# EAGLE schematic CAM_BOARD_V1_X (EAGLE 9.6.2)
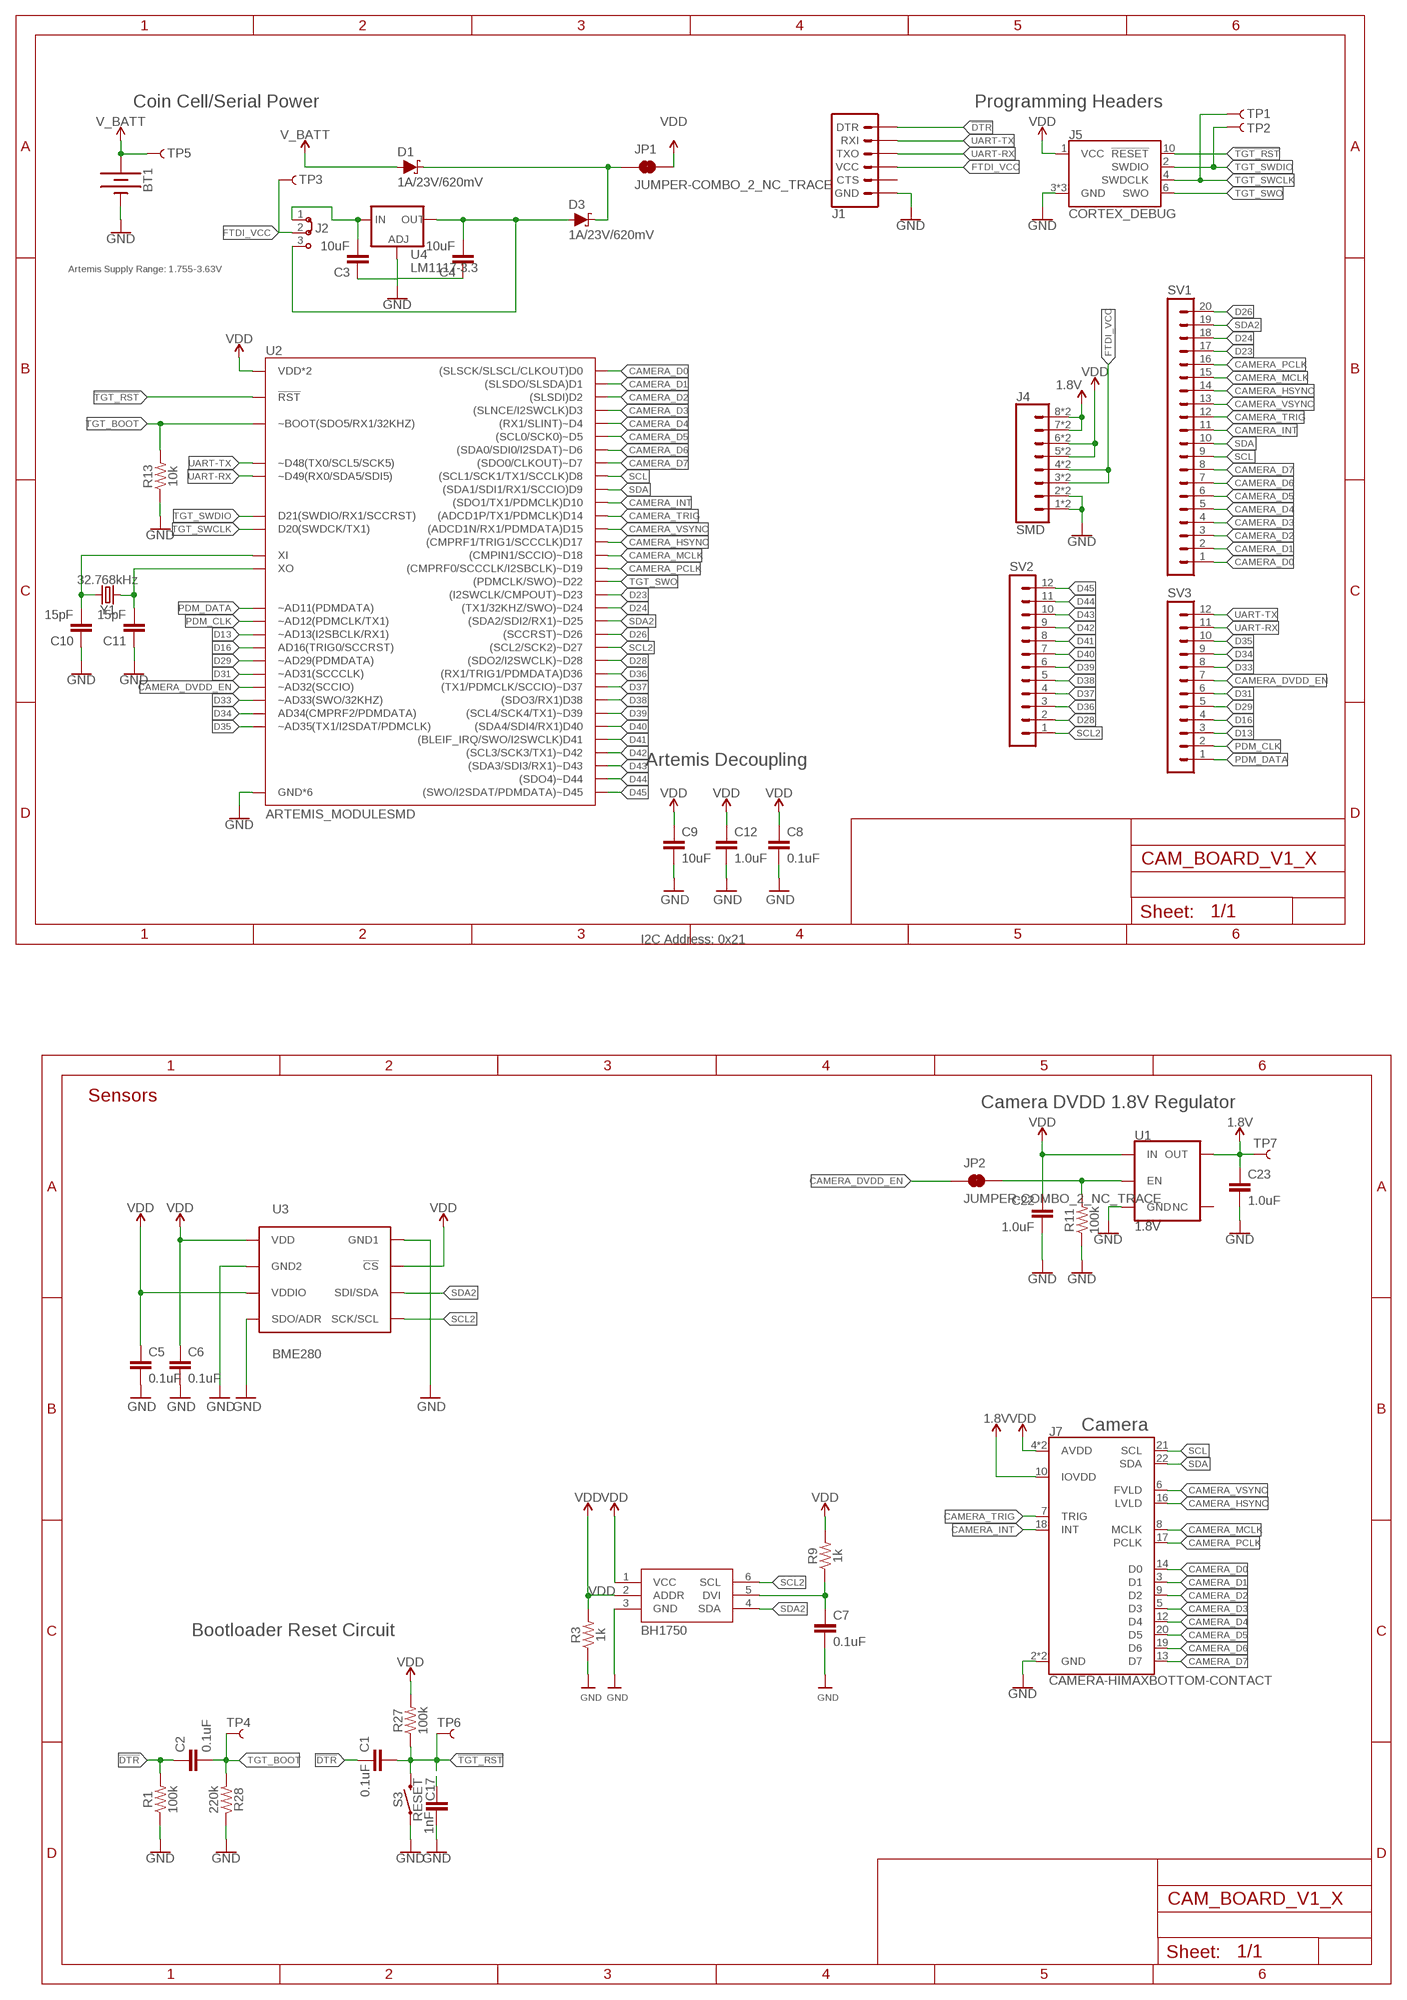
[diagram p0: schematic, sheet 1]

## Parts
BT1  BATTERY-20MM_SMD_4LEGS_OVERPASTE_INNER  [BATTCON_20MM_4LEGS_OVERPASTE_INNER]
C1  0.1uF  0.1UF-0603-25V-5%  [0603]
C2  0.1uF  0.1UF-0603-25V-(+80/-20%)  [0603]
C3  10uF  15PF-0603-50V-5%  [0603]
C4  10uF  15PF-0603-50V-5%  [0603]
C5  0.1uF  0.1UF-25V-5%(0603)  [0603-CAP]
C6  0.1uF  0.1UF-25V-5%(0603)  [0603-CAP]
C7  0.1uF  0.1UF-25V-5%(0603)  [0603-CAP]
C8  0.1uF  0.1UF-0402T-16V-10%  [0402-TIGHT]
C9  10uF  10UF-0603-6.3V-20%  [0603]
C10  15pF  15PF-0603-50V-5%  [0603]
C11  15pF  15PF-0603-50V-5%  [0603]
C12  1.0uF  1.0UF-0402T-16V-10%  [0402-TIGHT]
C17  1nF  1.0NF/1000PF-0603-50V-10%  [0603]
C22  1.0uF  1.0UF-0402-TIGHT-16V-10%  [0402-TIGHT]
C23  1.0uF  1.0UF-0402-TIGHT-16V-10%  [0402-TIGHT]
D1  1A/23V/620mV  DIODE-SCHOTTKY-BAT20J  [SOD-323]
D3  1A/23V/620mV  DIODE-SCHOTTKY-BAT20J  [SOD-323]
IC1  BH1750  [WSOF-6]
J1  6_PIN_SERIAL_TARGETSMD  [1X06-SMD_RA_MALE]
J2  J2X2MM  [04C]
J4  SMD  CONN_08SMD-COMBO-FEMALE  [1X08_SMD_COMBINED]
J5  CORTEX_DEBUG  CORTEX_DEBUG_MINIMUM_PTH  [2X5-PTH-1.27MM]
J7  CAMERA-HIMAXBOTTOM-CONTACT  [FPC-24-AMPHENOL-SFV24R-1STE1HLF]
JP1  JUMPER-COMBO_2_NC_TRACE  [COMBO-JUMPER_2_NC_TRACE]
JP2  JUMPER-COMBO_2_NC_TRACE  [COMBO-JUMPER_2_NC_TRACE]
R1  100k  100KOHM-0603-1/10W-1%  [0603]
R3  1k  1KOHM-0603-1/10W-1%  [0603@1]
R9  1k  1KOHM-0603-1/10W-1%  [0603@1]
R11  100k  100KOHM-0402T-1/16W-1%  [0402-TIGHT]
R13  10k  10KOHM-0603-1/10W-1%  [0603@1]
R27  100k  100KOHM-0603-1/10W-1%  [0603]
R28  220k  220KOHM-0603-1/10W-1%  [0603]
S3  RESET  MOMENTARY-SWITCH-SPST-SMD-4.6X2.8MM  [TACTILE_SWITCH_SMD_4.6X2.8MM]
SV1  MA20-1  [MA20-1]
SV2  MA12-1  [MA12-1]
SV3  MA12-1  [MA12-1]
TP1  TEST-POINT3X5  [PAD.03X.05]
TP2  TEST-POINT3X5  [PAD.03X.05]
TP3  TEST-POINT3X5  [PAD.03X.05]
TP4  TEST-POINT3X5  [PAD.03X.05]
TP5  TEST-POINT3X5  [PAD.03X.05]
TP6  TEST-POINT3X5  [PAD.03X.05]
TP7  TEST-POINT3X5  [PAD.03X.05]
U1  1.8V  V_REG_AP2127K-1.8V  [SOT23-5]
U2  ARTEMIS_MODULESMD  [ARTEMIS_FP]
U3  BME280  [BME280_LGA]
U4  LM1117-3.3  V_REG_LM1117SOT223  [SOT223]
Y1  32.768kHz  CRYSTAL-32.768KHZSMD-3.2X1.5  [CRYSTAL-SMD-3.2X1.5MM]

## Nets
1.8V: C23.1 J4.7 J4.7@2 J4.8 J4.8@2 J7.10(IOVDD) TP7.P$1 U1.5(OUT)
!DTR: C1.1 C2.1 J1.1(DTR) R1.2
!TGT_RST: C1.2 C17.1 J5.10(!RESET) R27.1 S3.3 S3.4 TP6.P$1 U2.~RST(!RST)
CAMERA_D0: J7.14(D0) SV1.1 U2.D0((SLSCK/SLSCL/CLKOUT)D0)
CAMERA_D1: J7.3(D1) SV1.2 U2.D1((SLSDO/SLSDA)D1)
CAMERA_D2: J7.9(D2) SV1.3 U2.D2((SLSDI)D2)
CAMERA_D3: J7.5(D3) SV1.4 U2.D3((SLNCE/I2SWCLK)D3)
CAMERA_D4: J7.12(D4) SV1.5 U2.~D4((RX1/SLINT)~D4)
CAMERA_D5: J7.20(D5) SV1.6 U2.~D5((SCL0/SCK0)~D5)
CAMERA_D6: J7.19(D6) SV1.7 U2.~D6((SDA0/SDI0/I2SDAT)~D6)
CAMERA_D7: J7.13(D7) SV1.8 U2.D7((SDO0/CLKOUT)~D7)
CAMERA_DVDD_EN: JP2.2 JP2.4 R11.2 SV3.7 U1.3(EN) U2.~AD32(~AD32(SCCIO))
CAMERA_HSYNC: J7.16(LVLD) SV1.14 U2.D17((CMPRF1/TRIG1/SCCCLK)D17)
CAMERA_INT: J7.18(INT) SV1.11 U2.D10((SDO1/TX1/PDMCLK)D10)
CAMERA_MCLK: J7.8(MCLK) SV1.15 U2.~D18((CMPIN1/SCCIO)~D18)
CAMERA_PCLK: J7.17(PCLK) SV1.16 U2.~D19((CMPRF0/SCCCLK/I2SBCLK)~D19)
CAMERA_TRIG: J7.7(TRIG) SV1.12 U2.D14((ADCD1P/TX1/PDMCLK)D14)
CAMERA_VSYNC: J7.6(FVLD) SV1.13 U2.D15((ADCD1N/RX1/PDMDATA)D15)
D13: SV3.3 U2.~AD13(~AD13(I2SBCLK/RX1))
D16: SV3.4 U2.AD16(AD16(TRIG0/SCCRST))
D23: SV1.17 U2.~D23((I2SWCLK/CMPOUT)~D23)
D24: SV1.18 U2.~D24((TX1/32KHZ/SWO)~D24)
D26: SV1.20 U2.~D26((SCCRST)~D26)
D28: SV2.2 U2.~D28((SDO2/I2SWCLK)~D28)
D29: SV3.5 U2.~AD29(~AD29(PDMDATA))
D31: SV3.6 U2.~AD31(~AD31(SCCCLK))
D33: SV3.8 U2.~AD33/SWO(~AD33(SWO/32KHZ))
D34: SV3.9 U2.AD34(AD34(CMPRF2/PDMDATA))
D35: SV3.10 U2.~AD35(~AD35(TX1/I2SDAT/PDMCLK))
D36: SV2.3 U2.D36((RX1/TRIG1/PDMDATA)D36)
D37: SV2.4 U2.~D37((TX1/PDMCLK/SCCIO)~D37)
D38: SV2.5 U2.D38((SDO3/RX1)D38)
D39: SV2.6 U2.~D39((SCL4/SCK4/TX1)~D39)
D40: SV2.7 U2.D40((SDA4/SDI4/RX1)D40)
D41: SV2.8 U2.D41((BLEIF_IRQ/SWO/I2SWCLK)D41)
D42: SV2.9 U2.~D42((SCL3/SCK3/TX1)~D42)
D43: SV2.10 U2.~D43((SDA3/SDI3/RX1)~D43)
D44: SV2.11 U2.~D44((SDO4)~D44)
D45: SV2.12 U2.~D45((SWO/I2SDAT/PDMDATA)~D45)
FTDI_VCC: J1.4(VCC) J2.2 J4.3 J4.3@2 J4.4 J4.4@2 TP3.P$1
GND: BT1.2(-) C3.1 C4.1 C5.2 C6.2 C7.2 C8.1 C9.2 C10.1 C11.1 C12.2 C17.2 C22.2 C23.2 IC1.3(GND) J1.6(GND) J4.1 J4.1@2 J4.2 J4.2@2 J5.3(GND) J5.5(GND) J5.9(GND) J7.2(GND) J7.15(GND) R1.1 R3.1 R11.1 R13.1 R28.1 S3.1 S3.2 U1.2(GND) U2.GND@1(GND*6) U2.GND@22(GND*6) U2.GND@38(GND*6) U2.GND@39(GND*6) U2.GND@47(GND*6) U2.GND@59(GND*6) U3.P$1(GND1) U3.P$5(SDO/ADR) U3.P$7(GND2) U4.1(ADJ)
N$1: JP2.1 JP2.3
N$2: C7.1 IC1.5(DVI) R9.1
N$3: C3.2 J2.1 U4.3(IN)
N$4: C4.2 D3.A J2.3 U4.2(OUT) U4.4(OUT)
N$14: C10.2 U2.XI Y1.P$2
N$15: C11.2 U2.XO Y1.P$1
PDM_CLK: SV3.2 U2.~AD12(~AD12(PDMCLK/TX1))
PDM_DATA: SV3.1 U2.~AD11(~AD11(PDMDATA))
SCL: J7.21(SCL) SV1.9 U2.D8((SCL1/SCK1/TX1/SCCLK)D8)
SCL2: IC1.6(SCL) SV2.1 U2.~D27((SCL2/SCK2)~D27) U3.P$4(SCK/SCL)
SDA: J7.22(SDA) SV1.10 U2.D9((SDA1/SDI1/RX1/SCCIO)D9)
SDA2: IC1.4(SDA) SV1.19 U2.~D25((SDA2/SDI2/RX1)~D25) U3.P$3(SDI/SDA)
TGT_BOOT: C2.2 R13.2 R28.2 TP4.P$1 U2.BOOT(~BOOT(SDO5/RX1/32KHZ))
TGT_SWCLK: J5.4(SWDCLK) TP1.P$1 U2.SWDCK(D20(SWDCK/TX1))
TGT_SWDIO: J5.2(SWDIO) TP2.P$1 U2.SWDIO(D21(SWDIO/RX1/SCCRST))
TGT_SWO: J5.6(SWO) U2.~D22((PDMCLK/SWO)~D22)
UART-RX: J1.3(TXO) SV3.11 U2.RXI-0(~D49(RX0/SDA5/SDI5))
UART-TX: J1.2(RXI) SV3.12 U2.TXO-0(~D48(TX0/SCL5/SCK5))
V_BATT: BT1.1(+) D1.A TP5.P$1
VDD: C5.1 C6.1 C8.2 C9.1 C12.1 C22.1 IC1.1(VCC) IC1.2(ADDR) J4.5 J4.5@2 J4.6 J4.6@2 J5.1(VCC) J7.4(AVDD) J7.11(AVDD) JP1.2 JP1.4 R3.2 R9.2 R27.2 U1.1(IN) U2.VDD@36(VDD*2) U2.VDD@37(VDD*2) U3.P$2(!CS) U3.P$6(VDDIO) U3.P$8(VDD)
VIN1: D1.C D3.C JP1.1 JP1.3
Unconnected: J1.5(CTS) J7.MNT1@0(MNT1) J7.MNT1@1(MNT1) J7.MNT2@0(MNT2) J7.MNT2@1(MNT2) U1.4(NC)

## Notes on the sheet
- Coin Cell/Serial Power | Programming Headers
- Artemis Supply Range: 1.755-3.63V
- Artemis Decoupling
- I2C Address: 0x21
- Sensors | Camera DVDD 1.8V Regulator
- Camera
- Bootloader Reset Circuit

## Library data of the parts
BT1 = SparkFun-Batteries:BATTERY: Battery - Single Cell A variety of battery chemistries, sizes, and footprints. Device List: 20MM_PTH - Coin Cell Battery Holder - 20mm (PTH) <https://www.sparkfun.com/products/783> 20MM_PTH_KIT- Coin Cell battery Holder - 20 mm (PTH) <http://www.sparkfun.com/products/783>kit version with special mask 6.8MM_PTH - Coin Cell Battery Holder - 6.8MM(SMD) <https://www.digikey.com/product-detail/en/seiko-instruments/MS621FE-FL11E/728-1057-ND/1889208?WT.srch=1&gclid=CNOQ5a6LzdQCFZS2wAodXCkE0g> 12MM_SMD - Coin Cell Battery Holder - 12mm (SMD) <https://www.sparkfun.com/products/10592> 12MM_PTH - Coin Cell Battery Holder - 12mm (PTH) <https://www.sparkfun.com/products/7948> 20MM_SMD - 20mm Coin Cell Battery Holder (SMD) (2 legs) Used on the Big Time Watch Kit <https://www.sparkfun.com/products/11734> 20MM_SMD_4LEGS - Coin Cell Battery Holder - 20mm (SMD) <https://www.sparkfun.com/products/11892> 20MM_SMD_4LEGS_OVERPASTE - Coin Cell Battery Holder - 20mm (SMD) <https://www.sparkfun.com/products/11892> (Over-paste on the legs) 24.5MM_PTH - Coin Cell Battery Holder - 24.5mm (PTH) <https://www.sparkfun.com/products/8863> 9V - 9V Battery Holder - PC Mount Used on the SparkFun SparkPunk Sound Kit <https://www.sparkfun.com/products/11177> and SparkFun SparkPunk Sequencer Kit <https://www.sparkfun.com/products/12707> 18650 - Battery Holder - 18650 (PTH) <https://www.sparkfun.com/products/13113> AA - Battery Holder - 1xAA (PTH) <https://www.sparkfun.com/products/7949> AAA - Battery Holder - 1xAAA (PTH) <https://www.sparkfun.com/products/12718> AA_KIT - Battery Holder - 1xAA (PTH) <https://www.sparkfun.com/products/7949> Special kit package - pads only have exposed copper on one side of the board. AAA_KIT - Battery Holder - 1xAAA (PTH) <https://www.sparkfun.com/products/12718> Special kit package - pads only have exposed copper on one side of the board.
C1 = SparkFun-Capacitors:0.1UF: 0.1µF ceramic capacitors A capacitor is a passive two-terminal electrical component used to store electrical energy temporarily in an electric field.; PROD_ID: CAP-08604
C2 = SparkFun-Capacitors:0.1UF: 0.1µF ceramic capacitors A capacitor is a passive two-terminal electrical component used to store electrical energy temporarily in an electric field.; PROD_ID: CAP-00810
C3 C4 = SparkFun-Capacitors:15PF: 15pF ceramic capacitors A capacitor is a passive two-terminal electrical component used to store electrical energy temporarily in an electric field.; PROD_ID: CAP-07881; VALUE: 15pF
C5-C7 = SparkFun-Capacitors:0.1UF-25V-5%(0603): CAP-08604; PROD_ID: CAP-08604
C8 = SparkFun-Capacitors:0.1UF: 0.1µF ceramic capacitors A capacitor is a passive two-terminal electrical component used to store electrical energy temporarily in an electric field.; PROD_ID: CAP-12416
C9 = SparkFun-Capacitors:10UF: 10.0µF ceramic capacitors A capacitor is a passive two-terminal electrical component used to store electrical energy temporarily in an electric field.; PROD_ID: CAP-11015
C10 C11 = SparkFun-Capacitors:15PF: 15pF ceramic capacitors A capacitor is a passive two-terminal electrical component used to store electrical energy temporarily in an electric field.; PROD_ID: CAP-07881
C12 = SparkFun-Capacitors:1.0UF: 1µF ceramic capacitors A capacitor is a passive two-terminal electrical component used to store electrical energy temporarily in an electric field.; PROD_ID: CAP-12417
C17 = SparkFun-Capacitors:1.0NF/1000PF: 1nF/1,000pF ceramic capacitors A capacitor is a passive two-terminal electrical component used to store electrical energy temporarily in an electric field.; PROD_ID: CAP-07886
C22 C23 = ambiq:1.0UF: 1µF ceramic capacitors A capacitor is a passive two-terminal electrical component used to store electrical energy temporarily in an electric field.; PROD_ID: CAP-12417
D1 D3 = SparkFun-DiscreteSemi:DIODE-SCHOTTKY: Schottky diode A Schottky diode is a semiconductor diode which has a low forward voltage drop and a very fast switching action.; PROD_ID: DIO-11623
IC1 = microbuilder:BH1750
J1 = SparkFun-Connectors:6_PIN_SERIAL_TARGET: 6-pin header connection for use with the "FTDI BASIC" pinout - TARGET SIDE. Also known as "Arduino Serial Program Header". It is used to mate with our FTDI Basic serial programmers using the Arduino IDE. Note, this device has "TARGET" in the name. It is intended to be used on a design that contains a target micro-controller that you wish to program. The "sister" device, named "CABLE" is inteneded to be used on a design that usually lives on the end of your USB cable and prvides the converter chip (FTDI232 or FTDI231x) to commnicate serial RX/TX. You can populate with some of these: Break Away Headers - Straight <https://www.sparkfun.com/products/116> (PRT-00116) For reference (or to suit your programming needs) check out these designs: SparkFun FTDI Basic Breakout - 5V <https://www.sparkfun.com/products/9716> (DEV-09716) SparkFun FTDI Basic Breakout - 3.3V <https://www.sparkfun.com/products/9873> (DEV-09873) SparkFun FTDI SmartBasic <https://www.sparkfun.com/products/12935> (DEV-12935) SparkFun Beefy 3 - FTDI Basic Breakout <https://www.sparkfun.com/products/13746> (DEV-13746); PROD_ID: CONN-08971
J2 = jumper:J2: Jumper switch 2 x 2.5 mm
J4 = SparkFun-Connectors:CONN_08: Multi connection point. Often used as Generic Header-pin footprint for 0.1 inch spaced/style header connections On any of the 0.1 inch spaced packages, you can populate with these: Break Away Headers - Straight <https://www.sparkfun.com/products/116> (PRT-00116) Break Away Male Headers - Right Angle <https://www.sparkfun.com/products/553> (PRT-00553) Female Headers <https://www.sparkfun.com/products/115> (PRT-00115) Break Away Headers - Machine Pin <https://www.sparkfun.com/products/117> (PRT-00117) Break Away Female Headers - Swiss Machine Pin <https://www.sparkfun.com/products/743> (PRT-00743) Arduino Stackable Header - 8 Pin <https://www.sparkfun.com/products/9279> (PRT-09279) For SCREWTERMINALS and SPRING TERMINALS visit here: Screw Terimnals on SparkFun.com <https://www.sparkfun.com/search/results?term=Screw+Terminals> (5mm/3.5mm/2.54mm spacing) This device is also useful as a general connection point to wire up your design to another part of your project. Our various solder wires solder well into these plated through hole pads. Hook-Up Wire - Assortment (Stranded, 22 AWG) <https://www.sparkfun.com/products/11375> (PRT-11375) Hook-Up Wire - Assortment (Solid Core, 22 AWG) <https://www.sparkfun.com/products/11367> (PRT-11367) View the entire wire category on our website here <https://www.sparkfun.com/categories/141> Special notes: Molex polarized connector foot print use with SKU : PRT-08231 with associated crimp pins and housings. 1MM SMD Version SKU: PRT-10208 NOTES ON THE VARIANTS LOCK and LOCK_LONGPADS... This footprint was designed to help hold the alignment of a through-hole component (i.e. 6-pin header) while soldering it into place. You may notice that each hole has been shifted either up or down by 0.005 of an inch from it's more standard position (which is a perfectly straight line). This slight alteration caused the pins (the squares in the middle) to touch the edges of the holes. Because they are alternating, it causes a "brace" to hold the component in place. 0.005 has proven to be the perfect amount of "off-center" position when using our standard breakaway headers. Although looks a little odd when you look at the bare footprint, once you have a header in there, the alteration is very hard to notice. Also,if you push a header all the way into place, it is covered up entirely on the bottom side.; PROD_ID: CONN-10204; SF_ID: PRT-11543
J5 = SparkFun-Connectors:CORTEX_DEBUG_MINIMUM: Cortex Debug Connector - 10 pin Supports JTAG debug, Serial Wire debug, and Serial Wire Viewer. PTH and SMD connector options available. General Connector Information <http://infocenter.arm.com/help/topic/com.arm.doc.faqs/attached/13634/cortex_debug_connectors.pdf> Products: PTH Connector <http://www.digikey.com/product-detail/en/cnc-tech/3220-10-0100-00/1175-1627-ND/3883661> -via Digi-Key SparkFun PSoc <https://www.sparkfun.com/products/13229> SparkFun T <https://www.sparkfun.com/products/13810>
J7 = SparkFun-Connectors:CAMERA-HIMAX; DIGIKEY: 609-4320-2-ND; PROD_ID: CONN-14233
JP1 JP2 = SparkFun-Jumpers:JUMPER-COMBO_2_NC_TRACE
R1 R27 = SparkFun-Resistors:100KOHM: 100kΩ resistor A resistor is a passive two-terminal electrical component that implements electrical resistance as a circuit element. Resistors act to reduce current flow, and, at the same time, act to lower voltage levels within circuits. - Wikipedia; PROD_ID: RES-07828
R3 R9 = SparkFun-Resistors:1KOHM: 1kΩ resistor A resistor is a passive two-terminal electrical component that implements electrical resistance as a circuit element. Resistors act to reduce current flow, and, at the same time, act to lower voltage levels within circuits. - Wikipedia; PROD_ID: RES-07856
R11 = SparkFun-Resistors:100KOHM: 100kΩ resistor A resistor is a passive two-terminal electrical component that implements electrical resistance as a circuit element. Resistors act to reduce current flow, and, at the same time, act to lower voltage levels within circuits. - Wikipedia; PROD_ID: RES-13495
R13 = SparkFun-Resistors:10KOHM: 10kΩ resistor A resistor is a passive two-terminal electrical component that implements electrical resistance as a circuit element. Resistors act to reduce current flow, and, at the same time, act to lower voltage levels within circuits. - Wikipedia; PROD_ID: RES-00824
R28 = SparkFun-Resistors:220KOHM: 220kΩ resistor A resistor is a passive two-terminal electrical component that implements electrical resistance as a circuit element. Resistors act to reduce current flow, and, at the same time, act to lower voltage levels within circuits. - Wikipedia; PROD_ID: RES-08969
S3 = SparkFun-Switches:MOMENTARY-SWITCH-SPST: Momentary Switch (Pushbutton) - SPST Normally-open (NO) SPST momentary switches (buttons, pushbuttons). Variants PTH-12MM - 12mm square, through-hole Momentary Pushbutton Switch - 12mm Square <https://www.sparkfun.com/products/9190> (COM-09190) PTH-6.0MM, PTH-6.0MM-KIT - 6.0mm square, through-hole Mini Pushbutton Switch <https://www.sparkfun.com/products/97> (COM-00097) KIT package intended for soldering kit's - only one side of pads' copper is exposed. PTH-RIGHT-ANGLE-KIT - Right-angle, through-hole Right Angle Tactile Button <https://www.sparkfun.com/products/10791> - Used on SparkFun BigTime Watch Kit <https://www.sparkfun.com/products/11734> SMD-12MM - 12mm square, surface-mount Tactile Button - SMD (12mm) <https://www.sparkfun.com/products/12993> (COM-12993) Used on SparkFun PicoBoard <https://www.sparkfun.com/products/11888> SMD-4.5MM - 4.5mm Square Trackball Switch Used on SparkFun Blackberry Trackballer Breakout <https://www.sparkfun.com/products/13169> SMD-4.6MMX2.8MM - 4.60mm x 2.80mm, surface mount Used on SparkFun SAMD21 Mini Breakout <https://www.sparkfun.com/products/13664> SMD-5.2MM, SMD-5.2-REDUNDANT - 5.2mm square, surface-mount Mini Pushbutton Switch - SMD <https://www.sparkfun.com/products/8720> (COM-08720) Used on Arduino Pro Mini <https://www.sparkfun.com/products/11114> REDUNDANT package connects both switch circuits together SMD-6.0X3.5MM - 6.0 x 3.5mm, surface mount Momentary Reset Switch SMD <https://www.sparkfun.com/products/8229> (COM-08229) SMD-6.2MM-TALL - 6.2mm square, surface mount Tactile Button - SMD (6mm) <https://www.sparkfun.com/products/12992> Used on SparkFun Digital Sandbox <https://www.sparkfun.com/products/12651> SMD-RIGHT-ANGLE - Right-angle, surface mount Used on SparkFun Block for Intel® Edison - Arduino <https://www.sparkfun.com/products/13036>; PROD_ID: SWCH-13065
SV1 = con-lstb:MA20-1: PIN HEADER; OC_FARNELL: unknown; OC_NEWARK: unknown
SV2 SV3 = con-lstb:MA12-1: PIN HEADER; OC_FARNELL: unknown; OC_NEWARK: unknown
TP1-TP7 = SparkFun-Connectors:TEST-POINT: SparkFun Test Points Bare copper test points for troubleshooting or In-Circuit-Testing. These are used by our Production team for verifying production board runs using pogo-pins on test beds. SparkFun Products: SparkFun LSM9DS1 Breakout <https://www.sparkfun.com/products/13284> SparkFun PSOC <https://www.sparkfun.com/products/13714> SparkFun Load Cell Amplifier <https://www.sparkfun.com/products/13879>
U1 = SparkFun-IC-Power:V_REG_AP2127: AP2127 - 300mA CMOS LDO Regulator w/ Enable The AP2127 is CMOS process low dropout linear regulator with enable function, the regulator delivers a guaranteed 300mA (min.) continuous load current. Features Output Voltage Accuracy: ±1.5% Output Current: 300mA (Min.) Foldback Short Current Protection: 50mA Enable Function to Turn ON/OFF VOUT Low Dropout Voltage (3.3V): 250mV (Typ.) @IOUT=600mA Excellent Load Regulation: 0.2%/A (Typ.) Excellent Line Regulation: 0.02%/V (Typ.) Low Quiescent Current: 55μA (Typ.) Low Standby Current: 0.01μA (Typ.) Low Output Noise: 50μVRMS PSRR: 100Hz -65dB, 1kHz -65dB OTSD Protection Stable with 1.0μF Flexible Cap: Ceramic, Tantalum and Aluminum Electrolytic Operation Temperature Range: -40°C to 85°C ESD: MM 400V, HBM 4000V; PROD_ID: VREG-14239
U2 = SparkFun-IC-Microcontroller:ARTEMIS_MODULE: Description: The Artemis Module from SparkFun is a Cortex-M4F with BLE 5.0 running up to 96MHz and with as low power as 6uA per MHz (less than 5mW). This is the world's first module to bridge the market between hobbyists and consumer products. We've packaged all the power of a modern microcontroller into a module that is both extremely easy to use but is mass-market ready. The flexibility of the Artemis module starts with our [Arduino core](https://github.com/sparkfun/Arduino_Apollo3). You can program and use the Artemis module just like you would an Uno or any other Arduino. Time to first blink is just 5 minutes away! We built the core from the ground up, making it fast and as light weight as possible.; PROD_ID: SUB-14479
U3 = BME280ComponentLibrary:BME280; PROD_ID: IC-13090
U4 = SparkFun-IC-Power:V_REG_LM1117: Voltage Regulator LM1117 Standard adjustable voltage regulator but in SMD form. Spark Fun Electronics SKU : COM-00595; PROD_ID: VREG-08170
Y1 = SparkFun-Clocks:CRYSTAL-32.768KHZ: 32.768kHz Crystal Frequency: 32.768kHz Frequency Stability: ±20ppm Load Capacitance: 12.5pF (PTH-2X6 & SMD-3.2X1.5), 6pF (SMD-2X6) SparkFun Products: SparkFun BigTime Watch Kit <https://www.sparkfun.com/products/11734> SparkFun nRF52832 Breakout <https://www.sparkfun.com/products/13990> SparkFun Real Time Clock Module <https://www.sparkfun.com/products/12708>; PROD_ID: XTAL-13062